# Altium project Ic Tester.PrjPcb
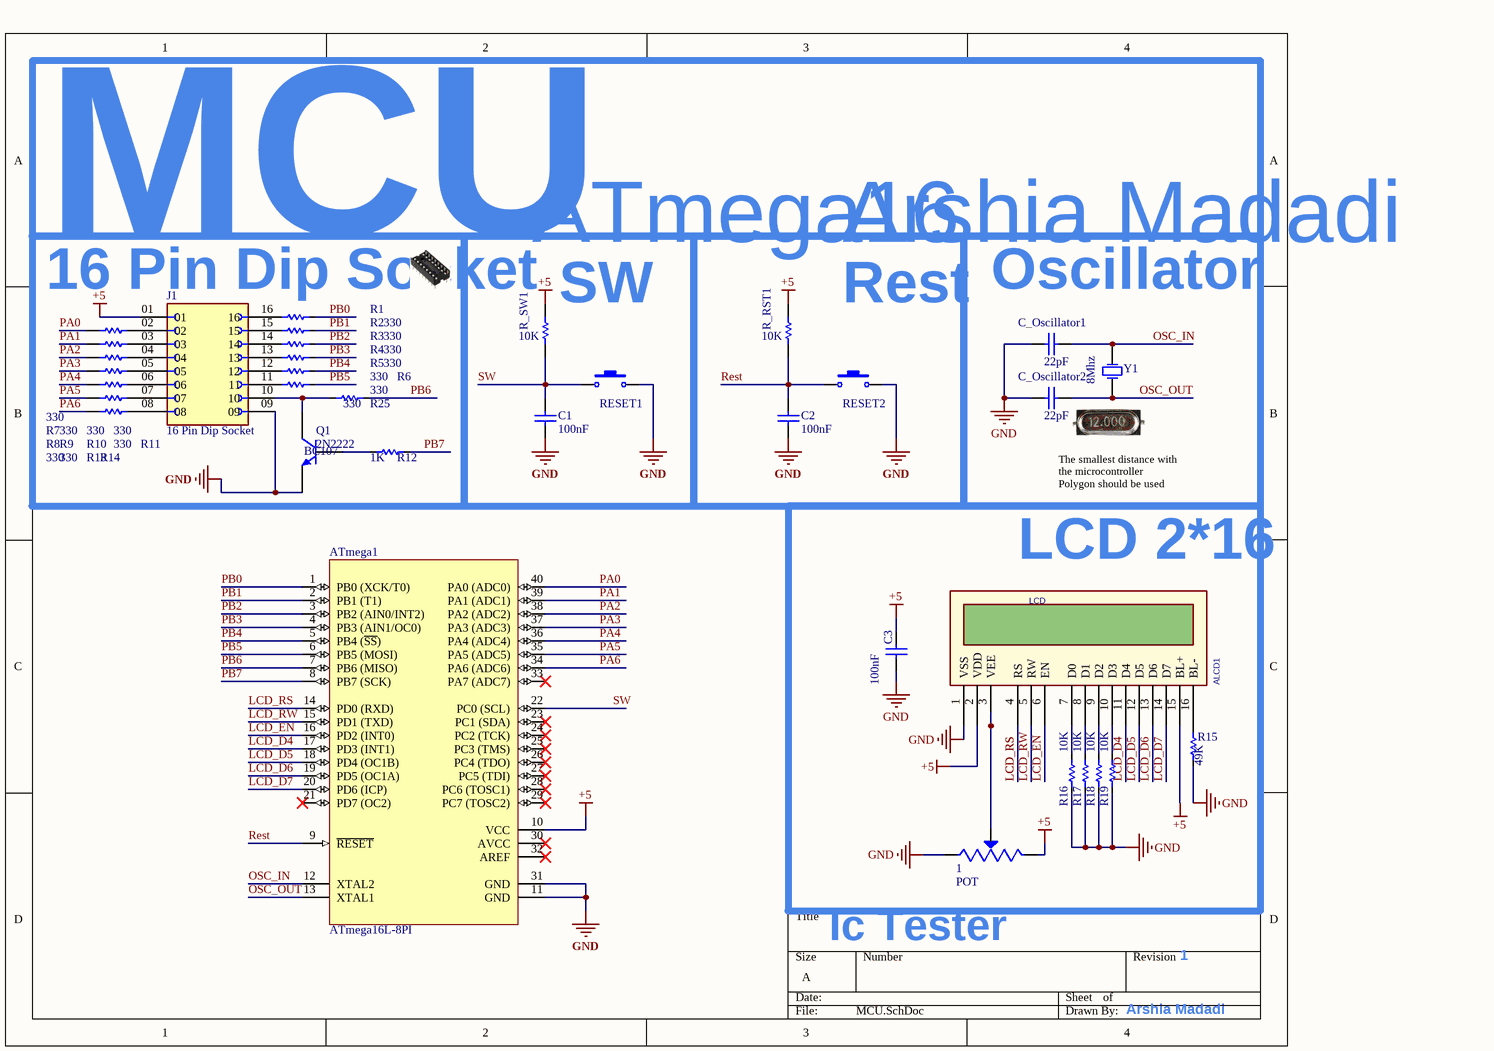
[diagram p0: MCU.SchDoc]
2 sheets, 56 parts. Net scope: global (net labels, ports and power ports of the same name join across sheets).
Board file: Ic Tester.PcbDoc
Sheets:
  MCU.SchDoc
  Power.SchDoc

## Sheet MCU.SchDoc
size A; SheetNumber: 1; SheetTotal: 2

### Parts
1  POT  [TRIM_3296W1103LF]
ALCD1  LCD  [LCD_2X16 BLUE - 2.5mm]
ATmega1  ATmega16L-8PI  [40P6]
C1  100nF  [CAPC4817X12N]
C2  100nF  [CAPC4817X12N]
C3  100nF  [CAPC4817X12N]
C_Oscillator1  22pF  [CAPC4817X12N]
C_Oscillator2  22pF  [CAPC4817X12N]
J1  16 Pin Dip Socket  [AMPHENOL_DILB16P-223TLF]
Q1  2N2222  [2N2222]
R1  330  [1206_Res]
R2  330  [1206_Res]
R3  330  [1206_Res]
R4  330  [1206_Res]
R5  330  [1206_Res]
R6  330  [1206_Res]
R7  330  [RESC4817X04N]
R8  330  [RESC4817X04N]
R9  330  [RESC4817X04N]
R10  330  [RESC4817X04N]
R11  330  [RESC4817X04N]
R12  1K  [1206_Res]
R13  330  [RESC4817X04N]
R14  330  [RESC4817X04N]
R15  49K  [1206_Res]
R16  10K  [1206_Res]
R17  10K  [1206_Res]
R18  10K  [1206_Res]
R19  10K  [1206_Res]
R25  330  [1206_Res]
R_RST1  10K  [RESC4817X04N]
R_SW1  10K  [RESC4817X04N]
RESET1  Switch PB  [Switch - Push to On]  (value not drawn)
RESET2  Switch PB  [Switch - Push to On]  (value not drawn)
Y1  8Mhz  [Crystal]

### Blocks framed on the sheet
MCU: J1 Q1 R1-R14 R25
ATmega16: C1 R_SW1 RESET1
Arshia Madadi: C2 R_RST1 RESET2
Oscillator: C_Oscillator1 C_Oscillator2 Y1
LCD 2*16: 1 ALCD1 C3 R15-R19

### Nets
+5: 1.3(CW) ALCD1.2(VDD) ALCD1.15(BL+) ATmega1.10(VCC) C3.2 J1.01 R_RST1.2 R_SW1.2
GND: 1.1(CCW) ALCD1.1(VSS) ATmega1.11(GND) ATmega1.31(GND) C1.1 C2.1 C3.1 C_Oscillator1.1 C_Oscillator2.1 J1.09 Q1.1(E) R15.2 R16.1 R17.1 R18.1 R19.1 RESET1.2 RESET2.2
LCD_D4: ALCD1.11(D4) ATmega1.17(PD3_(INT1))
LCD_D5: ALCD1.12(D5) ATmega1.18(PD4_(OC1B))
LCD_D6: ALCD1.13(D6) ATmega1.19(PD5_(OC1A))
LCD_D7: ALCD1.14(D7) ATmega1.20(PD6_(ICP))
LCD_EN: ALCD1.6(EN) ATmega1.16(PD2_(INT0))
LCD_RS: ALCD1.4(RS) ATmega1.14(PD0_(RXD))
LCD_RW: ALCD1.5(RW) ATmega1.15(PD1_(TXD))
OSC_IN: ATmega1.12(XTAL2) C_Oscillator1.2 Y1.2(OSC2)
OSC_OUT: ATmega1.13(XTAL1) C_Oscillator2.2 Y1.1(OSC1)
PA0: ATmega1.40(PA0_(ADC0)) R10.2
PA1: ATmega1.39(PA1_(ADC1)) R9.2
PA2: ATmega1.38(PA2_(ADC2)) R14.2
PA3: ATmega1.37(PA3_(ADC3)) R13.2
PA4: ATmega1.36(PA4_(ADC4)) R11.2
PA5: ATmega1.35(PA5_(ADC5)) R8.2
PA6: ATmega1.34(PA6_(ADC6)) R7.2
PB0: ATmega1.1(PB0_(XCK/T0)) R1.1
PB1: ATmega1.2(PB1_(T1)) R2.1
PB2: ATmega1.3(PB2_(AIN0/INT2)) R3.1
PB3: ATmega1.4(PB3_(AIN1/OC0)) R4.1
PB4: ATmega1.5(PB4_(~{SS})) R5.1
PB5: ATmega1.6(PB5_(MOSI)) R6.1
PB6: ATmega1.7(PB6_(MISO)) R25.1
PB7: ATmega1.8(PB7_(SCK)) R12.1
Rest: ATmega1.9(~{RESET}) C2.2 R_RST1.1 RESET2.1
SW: ATmega1.22(PC0_(SCL)) C1.2 R_SW1.1 RESET1.1
Net1_2: 1.2(WIPER) ALCD1.3(VEE)
NetALCD1_7: ALCD1.7(D0) R16.2
NetALCD1_8: ALCD1.8(D1) R17.2
NetALCD1_9: ALCD1.9(D2) R18.2
NetALCD1_10: ALCD1.10(D3) R19.2
NetALCD1_16: ALCD1.16(BL-) R15.1
NetJ1_02: J1.02 R10.1
NetJ1_03: J1.03 R9.1
NetJ1_04: J1.04 R14.1
NetJ1_05: J1.05 R13.1
NetJ1_06: J1.06 R11.1
NetJ1_07: J1.07 R8.1
NetJ1_08: J1.08 R7.1
NetJ1_10: J1.10 Q1.3(C) R25.2
NetJ1_11: J1.11 R6.2
NetJ1_12: J1.12 R5.2
NetJ1_13: J1.13 R4.2
NetJ1_14: J1.14 R3.2
NetJ1_15: J1.15 R2.2
NetJ1_16: J1.16 R1.2
NetQ1_2: Q1.2(B) R12.2

Not connected (* = marked no-connect by the designer): ATmega1 21(PD7_(OC2))* 23(PC1_(SDA))* 24(PC2_(TCK))* 25(PC3_(TMS))* 26(PC4_(TDO))* 27(PC5_(TDI))* 28(PC6_(TOSC1))* 29(PC7_(TOSC2))* 30(AVCC)* 32(AREF)* 33(PA7_(ADC7))*

### Notes on the sheet
- 16 Pin Dip Socket
- (near R_SW1) SW
- Rest
- The smallest distance with the microcontroller
  Polygon should be used
- (near 1) Ic Tester
- 1
- Arshia Madadi
- (in symbol 2N2222) BC107

### Library data of the parts
1 = 3296W1103LF: Trimmer, Potentiometer 10kohm 25turn Thd; MF: Bourns; Package: None; MP: 3296W1103LF; Check_prices: https://www.snapeda.com/parts/3296W1103LF/Bourns/view-part/2487625/?ref=eda; Availability: Unavailable; Price: None; Value: *; SnapEDA_Link: https://www.snapeda.com/parts/3296W1103LF/Bourns/view-part/2487625/?ref=snap
ALCD1 = LCD: Alphanumic LCD; Designer: Abbas Basereh; Data: 16-12-2016
ATmega1 = ATmega16L-8PI: 8-Bit AVR Microcontroller with 16K Bytes of In-System Programmable Flash Memory; Published: 2017-1-4; DatasheetVersion: 2466E-AVR-10/02; PackageVersion: 2017-1-4; PackageReference: 40P6; Publisher: Abbas Basereh; PackageDescription: 40-lead (0.600"/15.24mm Wide) Plastic Dual Inline Package (PDIP); Supplier 1: Digi-Key; Supplier Part Number 1: ATMEGA16L-8PI-ND; Supplier 2: Mouser; Supplier Part Number 2: 556-ATMEGA16L-8PI; Code_JEDEC: MS-011-AC; ComponentLink1Description: Datasheet; ComponentLink1URL: http://www.atmel.com/dyn/resources/prod_documents/doc2466.pdf; ComponentLink2Description: Atmel.com Home; ComponentLink2URL: http://www.atmel.com
C1-C3 C_Oscillator1 C_Oscillator2 = CAP SMD 1206: CAP 1206; Designer: Abbas Basereh; Desc.: CAP SMD 1206; Data: 16-12-2016
J1 = DILB16P-223TLF: DIP Socket, Stamped and Formed; MF: Amphenol ICC (FCI); Check_prices: https://www.snapeda.com/parts/DILB16P-223TLF/Amphenol+FCI/view-part/?ref=eda; Package: None; Price: None; Value: *; MP: DILB16P-223TLF; SnapEDA_Link: https://www.snapeda.com/parts/DILB16P-223TLF/Amphenol+FCI/view-part/?ref=snap; Availability: In Stock
Q1 = 2N2222: NPN Transistor
R1-R6 R12 R15-R19 R25 = Res: Resistor; Published: 8-Jun-2000; LatestRevisionDate: 17-Jul-2002; LatestRevisionNote: Re-released for DXP Platform.; PackageReference: AXIAL-0.3; Publisher: Altium Limited
R7-R11 R13 R14 R_RST1 R_SW1 = RES 1206 0.25W: RES 1206; Designer: Abbas Basereh; Desc.: RES SMD 1206; Data: 16-12-2016
RESET1 RESET2 = Switch PB: Push Button Switch
Y1 = XTAL: Crystal Oscillator; Published: 8-Jun-2000; LatestRevisionDate: 17-Jul-2002; LatestRevisionNote: Re-released for DXP Platform.; PackageReference: R38; Publisher: Altium Limited

## Sheet Power.SchDoc
size A; SheetNumber: 2; SheetTotal: 2
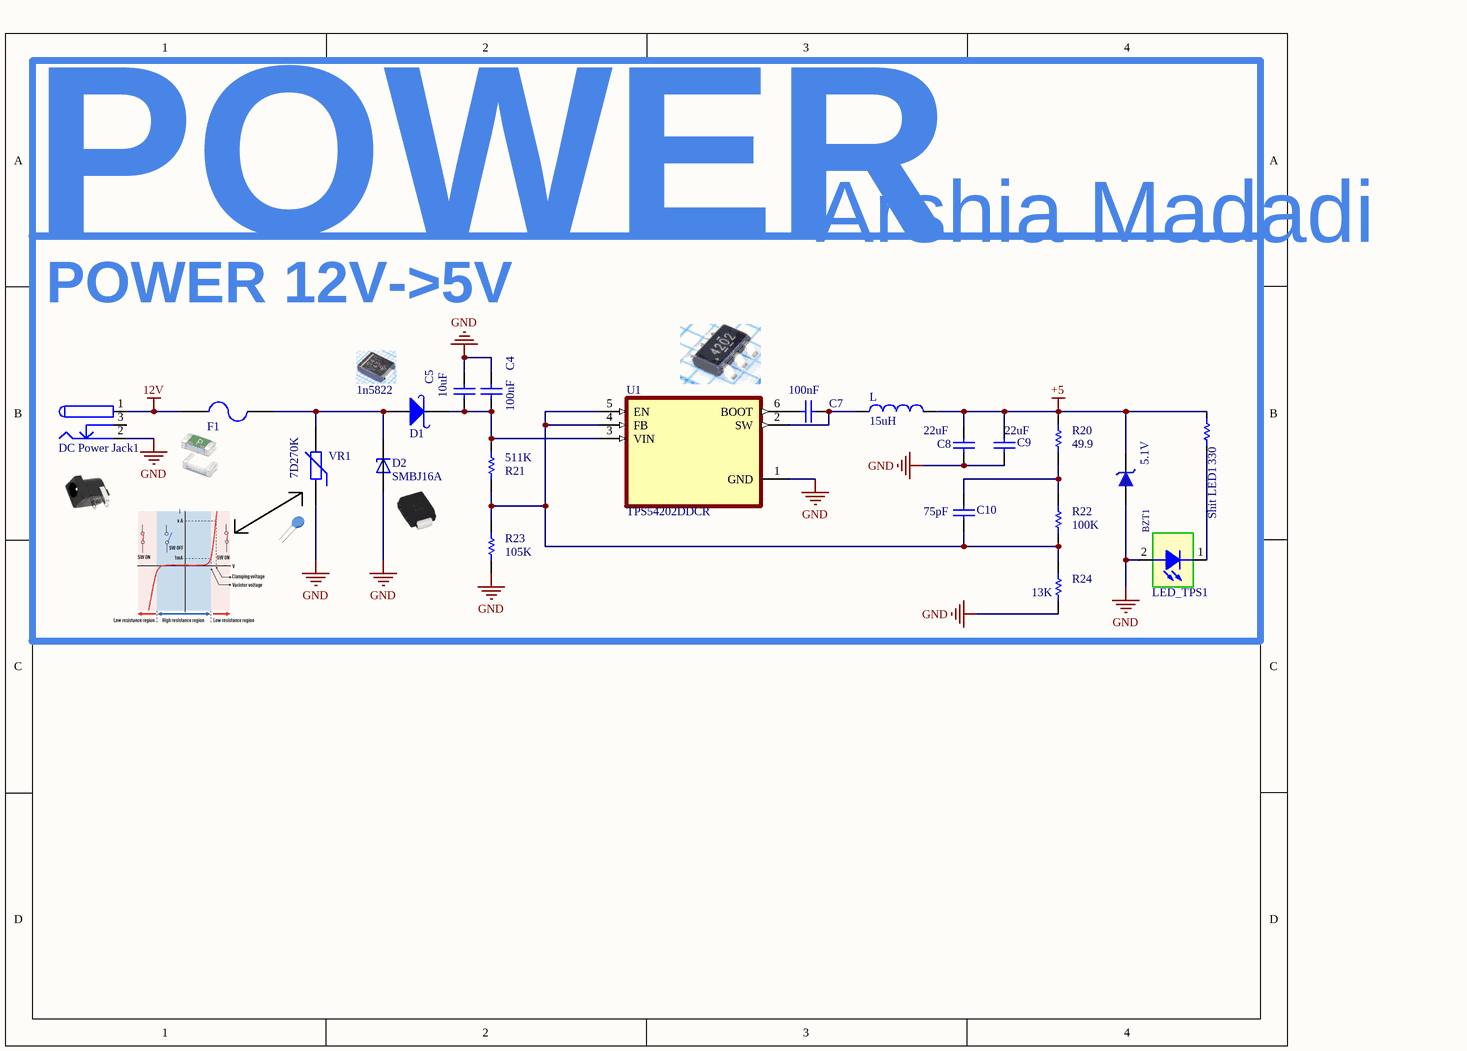
[diagram p1: Power.SchDoc]

### Parts
BZT1  5.1V  [SOD123]
C4  100nF  [CAPC4817X12N]
C5  10uF  [CAPC4817X12N]
C7  100nF  [CAPC4817X12N]
C8  22uF  [CAPC4817X12N]
C9  22uF  [CAPC4817X12N]
C10  75pF  [CAPC4817X12N]
D1  1n5822  [DO-214AB(SMC)]
D2  SMBJ16A  [DIOM4336X265N]
DC_Power_Jack1  DC Power Jack  [DC Power Jack 1]  (value not drawn)
F1  F=3.0 A  [1206 FUSE]  (value not drawn)
L  15uH  [IND1206]
LED_TPS1  SMD 1206 LED  [LED 1206]  (value not drawn)
R20  49.9  [RESC4817X04N]
R21  511K  [RESC4817X04N]
R22  100K  [RESC4817X04N]
R23  105K  [RESC4817X04N]
R24  13K  [RESC4817X04N]
Shit_LED1  330  [1206_Res]
U1  TPS54202DDCR  [SOT95P280X110-6N]
VR1  7D270K  [07D XXX]

### Nets
12V: DC_Power_Jack1.1 F1.1
+5: BZT1.2 C8.2 C9.2 L.2 R20.2 Shit_LED1.2
GND: BZT1.1 C4.2 C5.2 C8.1 C9.1 D2.A DC_Power_Jack1.2 LED_TPS1.2 R23.1 R24.1 U1.1(GND) VR1.1
NetC4_1: C4.1 C5.1 D1.2(K) R21.2 U1.3(VIN)
NetC7_1: C7.1 U1.6(BOOT)
NetC7_2: C7.2 L.1 U1.2(SW)
NetC10_1: C10.1 R21.1 R22.1 R23.2 R24.2 U1.4(FB) U1.5(EN)
NetC10_2: C10.2 R20.1 R22.2
NetD1_1: D1.1(A) D2.C F1.2 VR1.2
NetLED_TPS1_1: LED_TPS1.1 Shit_LED1.1

Not connected (* = marked no-connect by the designer): DC_Power_Jack1 3

### Notes on the sheet
- Arshia Madadi
- POWER
- POWER 12V->5V

### Library data of the parts
BZT1 = ZENER GENERAL DIODE: DIODE ZENER GENERAL; VALUE: 12V; Published: 2017-1-12; PackageVersion: 2017-1-12; PackageReference: DO 35; Publisher: Abbas Basereh; PackageDescription: DIODE GEN ZENER; ComponentLink1Description: Manufacturer Link; ComponentLink2Description: Datasheet
C4 C5 C7-C10 = CAP SMD 1206: CAP 1206; Designer: Abbas Basereh; Desc.: CAP SMD 1206; Data: 16-12-2016
D1 = 1N5822 SMD: Schottky Rectifiers; Part. No: SS34; Manufacturer: ON Semiconductor/Fairchild; Designer: Abbas Basereh; Link: https://www.aliexpress.com/item/Free-shipping-100pcs-1n5822-sma-smd-do-214ac-Schottky-diode-ss34/32337482329.html?spm=2114.01010208.3.1.zLZDsP&ws_ab_test=searchweb0_0,searchweb201602_4_10065_10068_10084_10083_10080_10082_10081_10060_10061_10062_10056_10055_10054_10059_10099_10078_10079_427_10073_10103_10102_10096_10052_10050_10051,searchweb201603_4&btsid=6e50dc92-ac69-45bc-a19e-209af19ce602; Link: http://www.tme.eu/en/details/ss34/smd-schottky-diodes/vishay/ss34-e357t/; Link: http://www.digikey.com/product-detail/en/on-semiconductor-fairchild/SS34/SS34FSCT-ND/2094459; Data: 16-12-2016
D2 = SMBJ16A: 600W, 18.8V, 5%, Unidirectional, TVS; MF: Taiwan Semiconductor; MP: SMBJ16A; SnapEDA_Link: https://www.snapeda.com/parts/SMBJ16A/Taiwan+Semiconductor/view-part/?ref=snap; Check_prices: https://www.snapeda.com/parts/SMBJ16A/Taiwan+Semiconductor/view-part/?ref=eda; Price: None; Availability: In Stock; Purchase-URL: https://pricing.snapeda.com/search/part/SMBJ16A/?ref=eda; Package: SMD-2-2 Avago; Value: *
DC_Power_Jack1 = DC Power Jack: DC Power Jack. Center Pin 2.5mm. Diameter: 5.7mm; Designer: Ali Hafizi; Company: Personal; Project Name: Laser; Adding Date: 10/21/2009
F1 = Fuse SMD1206: SMD Fuses 1206; Designer: Abbas Basereh; Desc.: SMD Fuses 1206; Data: 16-12-2016
L = INDUCTOR SMD PACKAGE: TOTAL INDUCTOR SMD PACK; Designer: Abbas Basereh; Desc.: INDUCTOR  SMD TOTAL PACKAGES; VALUE: 1u; Data: 2017-3-10
LED_TPS1 = LED SMD 1206
R20-R24 = RES 1206 0.25W: as R7 on sheet MCU; Data: 16-12-2016
Shit_LED1 = Res: Resistor; Published: 8-Jun-2000; LatestRevisionDate: 17-Jul-2002; LatestRevisionNote: Re-released for DXP Platform.; PackageReference: AXIAL-0.3; Publisher: Altium Limited
U1 = TPS54202DDCR: 4.5V to 28V Input, 2A Output, EMI Friendly Synchronous Step-Down Converter 6-SOT-23-THIN -40 to 125; MF: Texas Instruments; Price: None; Value: *; Texas_Instruments-Purchase-URL: https://snapeda.com/shop?store=Texas+Instruments&id=565860; Mouser-Purchase-URL: https://snapeda.com/shop?store=Mouser&id=565860; Package: SOT-23-THN-6 Texas Instruments; SnapEDA_Link: https://www.snapeda.com/parts/TPS54202DDCR/Texas%20Instruments/view-part/565860/?ref=snap; Availability: Good; MP: TPS54202DDCR; DigiKey-Purchase-URL: https://snapeda.com/shop?store=DigiKey&id=565860
VR1 = VARISTOR (VDR): VARISTORS; Manufacturer: china-canada-philipina; Designer: Abbas Basereh; VALUE: xxDxxx; Models: MOV-VDR-COV; Data: 2017-1-5; Link: digikey.com; PUBLISHER: ABBAS BASEREH

## Nets that join several sheets
+5: MCU (8 pins), Power (6 pins)
GND: MCU (18 pins), Power (12 pins)